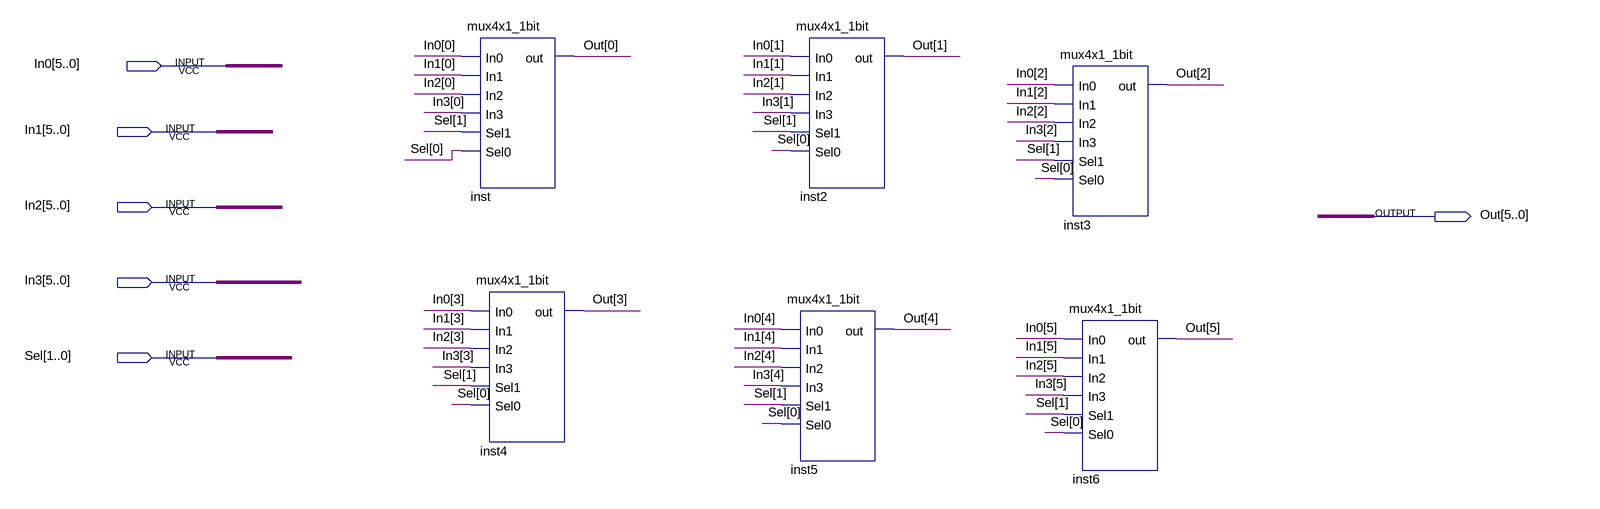
[diagram p0: schematic sheet]
// Quartus schematic mux4x1_6bit.bdf as structural Verilog: 6 symbols, 6 pins
module mux4x1_6bit (
  input  [5:0] In0,
  input  [5:0] In1,
  input  [5:0] In2,
  input  [5:0] In3,
  input  [1:0] Sel,
  output [5:0] Out
);

  mux4x1_1bit inst (.In0(In0[0]), .In1(In1[0]), .In2(In2[0]), .In3(In3[0]), .Sel1(Sel[1]), .Sel0(Sel[0]), .out(Out[0]));
  mux4x1_1bit inst4 (
    .In0(In0[3]), .In1(In1[3]), .In2(In2[3]), .In3(In3[3]), .Sel1(Sel[1]), .Sel0(Sel[0]), .out(Out[3]));
  mux4x1_1bit inst2 (
    .In0(In0[1]), .In1(In1[1]), .In2(In2[1]), .In3(In3[1]), .Sel1(Sel[1]), .Sel0(Sel[0]), .out(Out[1]));
  mux4x1_1bit inst5 (
    .In0(In0[4]), .In1(In1[4]), .In2(In2[4]), .In3(In3[4]), .Sel1(Sel[1]), .Sel0(Sel[0]), .out(Out[4]));
  mux4x1_1bit inst3 (
    .In0(In0[2]), .In1(In1[2]), .In2(In2[2]), .In3(In3[2]), .Sel1(Sel[1]), .Sel0(Sel[0]), .out(Out[2]));
  mux4x1_1bit inst6 (
    .In0(In0[5]), .In1(In1[5]), .In2(In2[5]), .In3(In3[5]), .Sel1(Sel[1]), .Sel0(Sel[0]), .out(Out[5]));
endmodule
